# Altium schematic sheet Boom Control.SchDoc
size A3; SheetNumber: 5; SheetTotal: 5
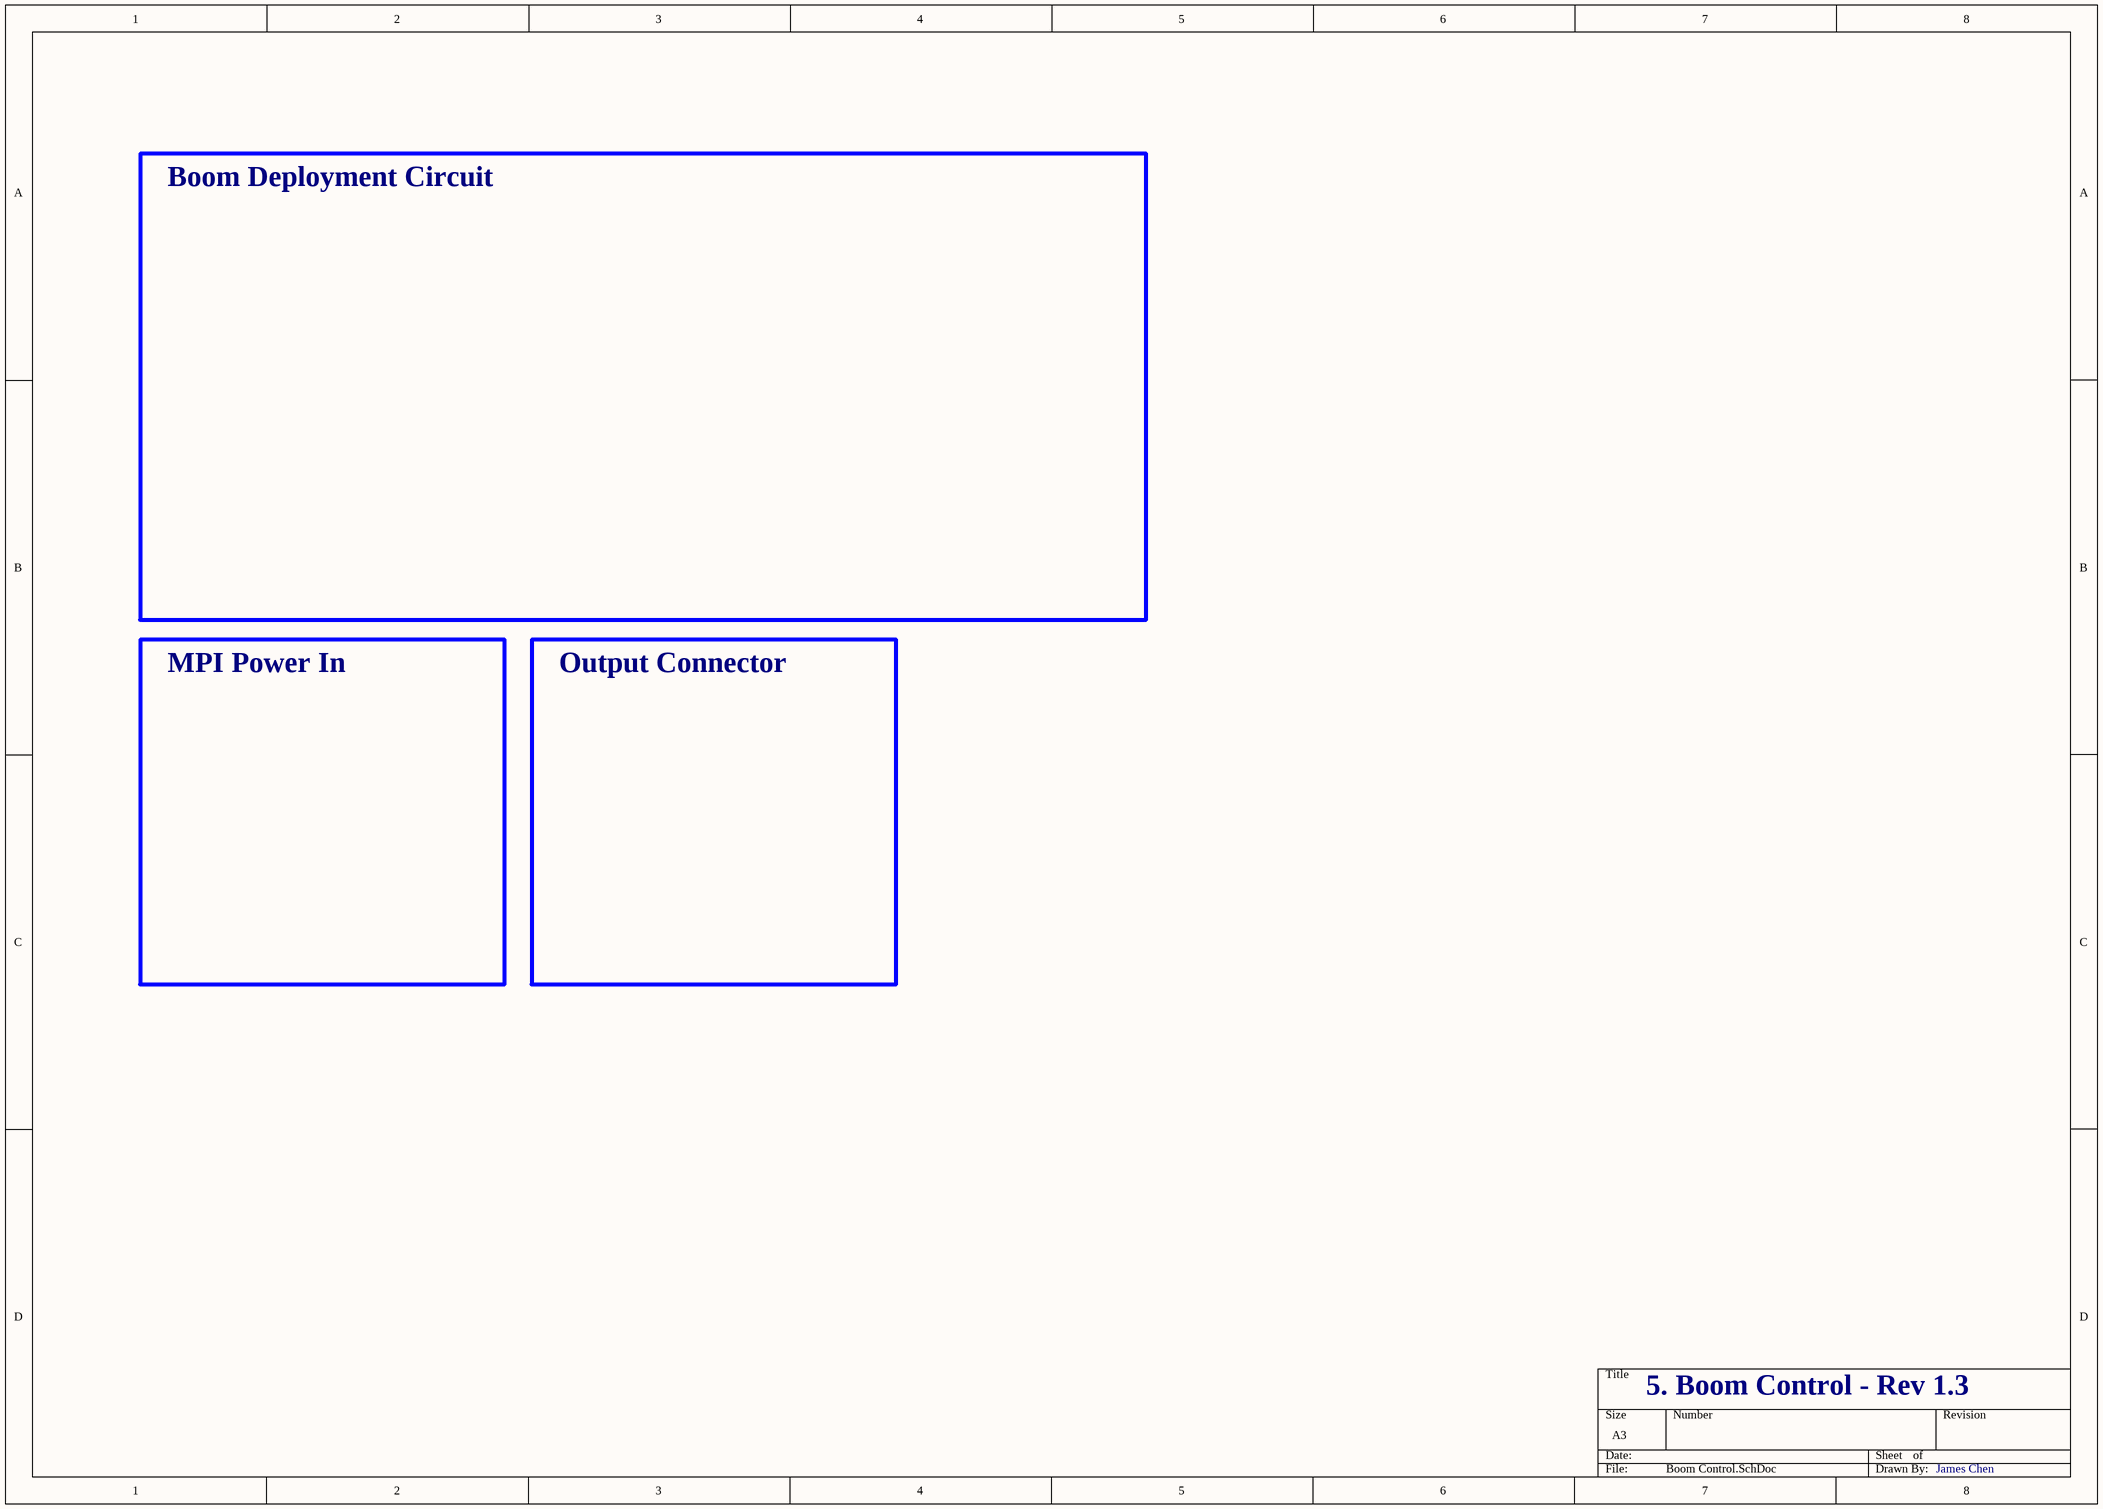
[diagram p0: Boom Control.SchDoc]

## Notes on the sheet
- Boom Deployment Circuit
- MPI Power In
- Output Connector
- 5. Boom Control - Rev 1.3
- James Chen